# EAGLE schematic fadecandybreakout (EAGLE 6.5.0)
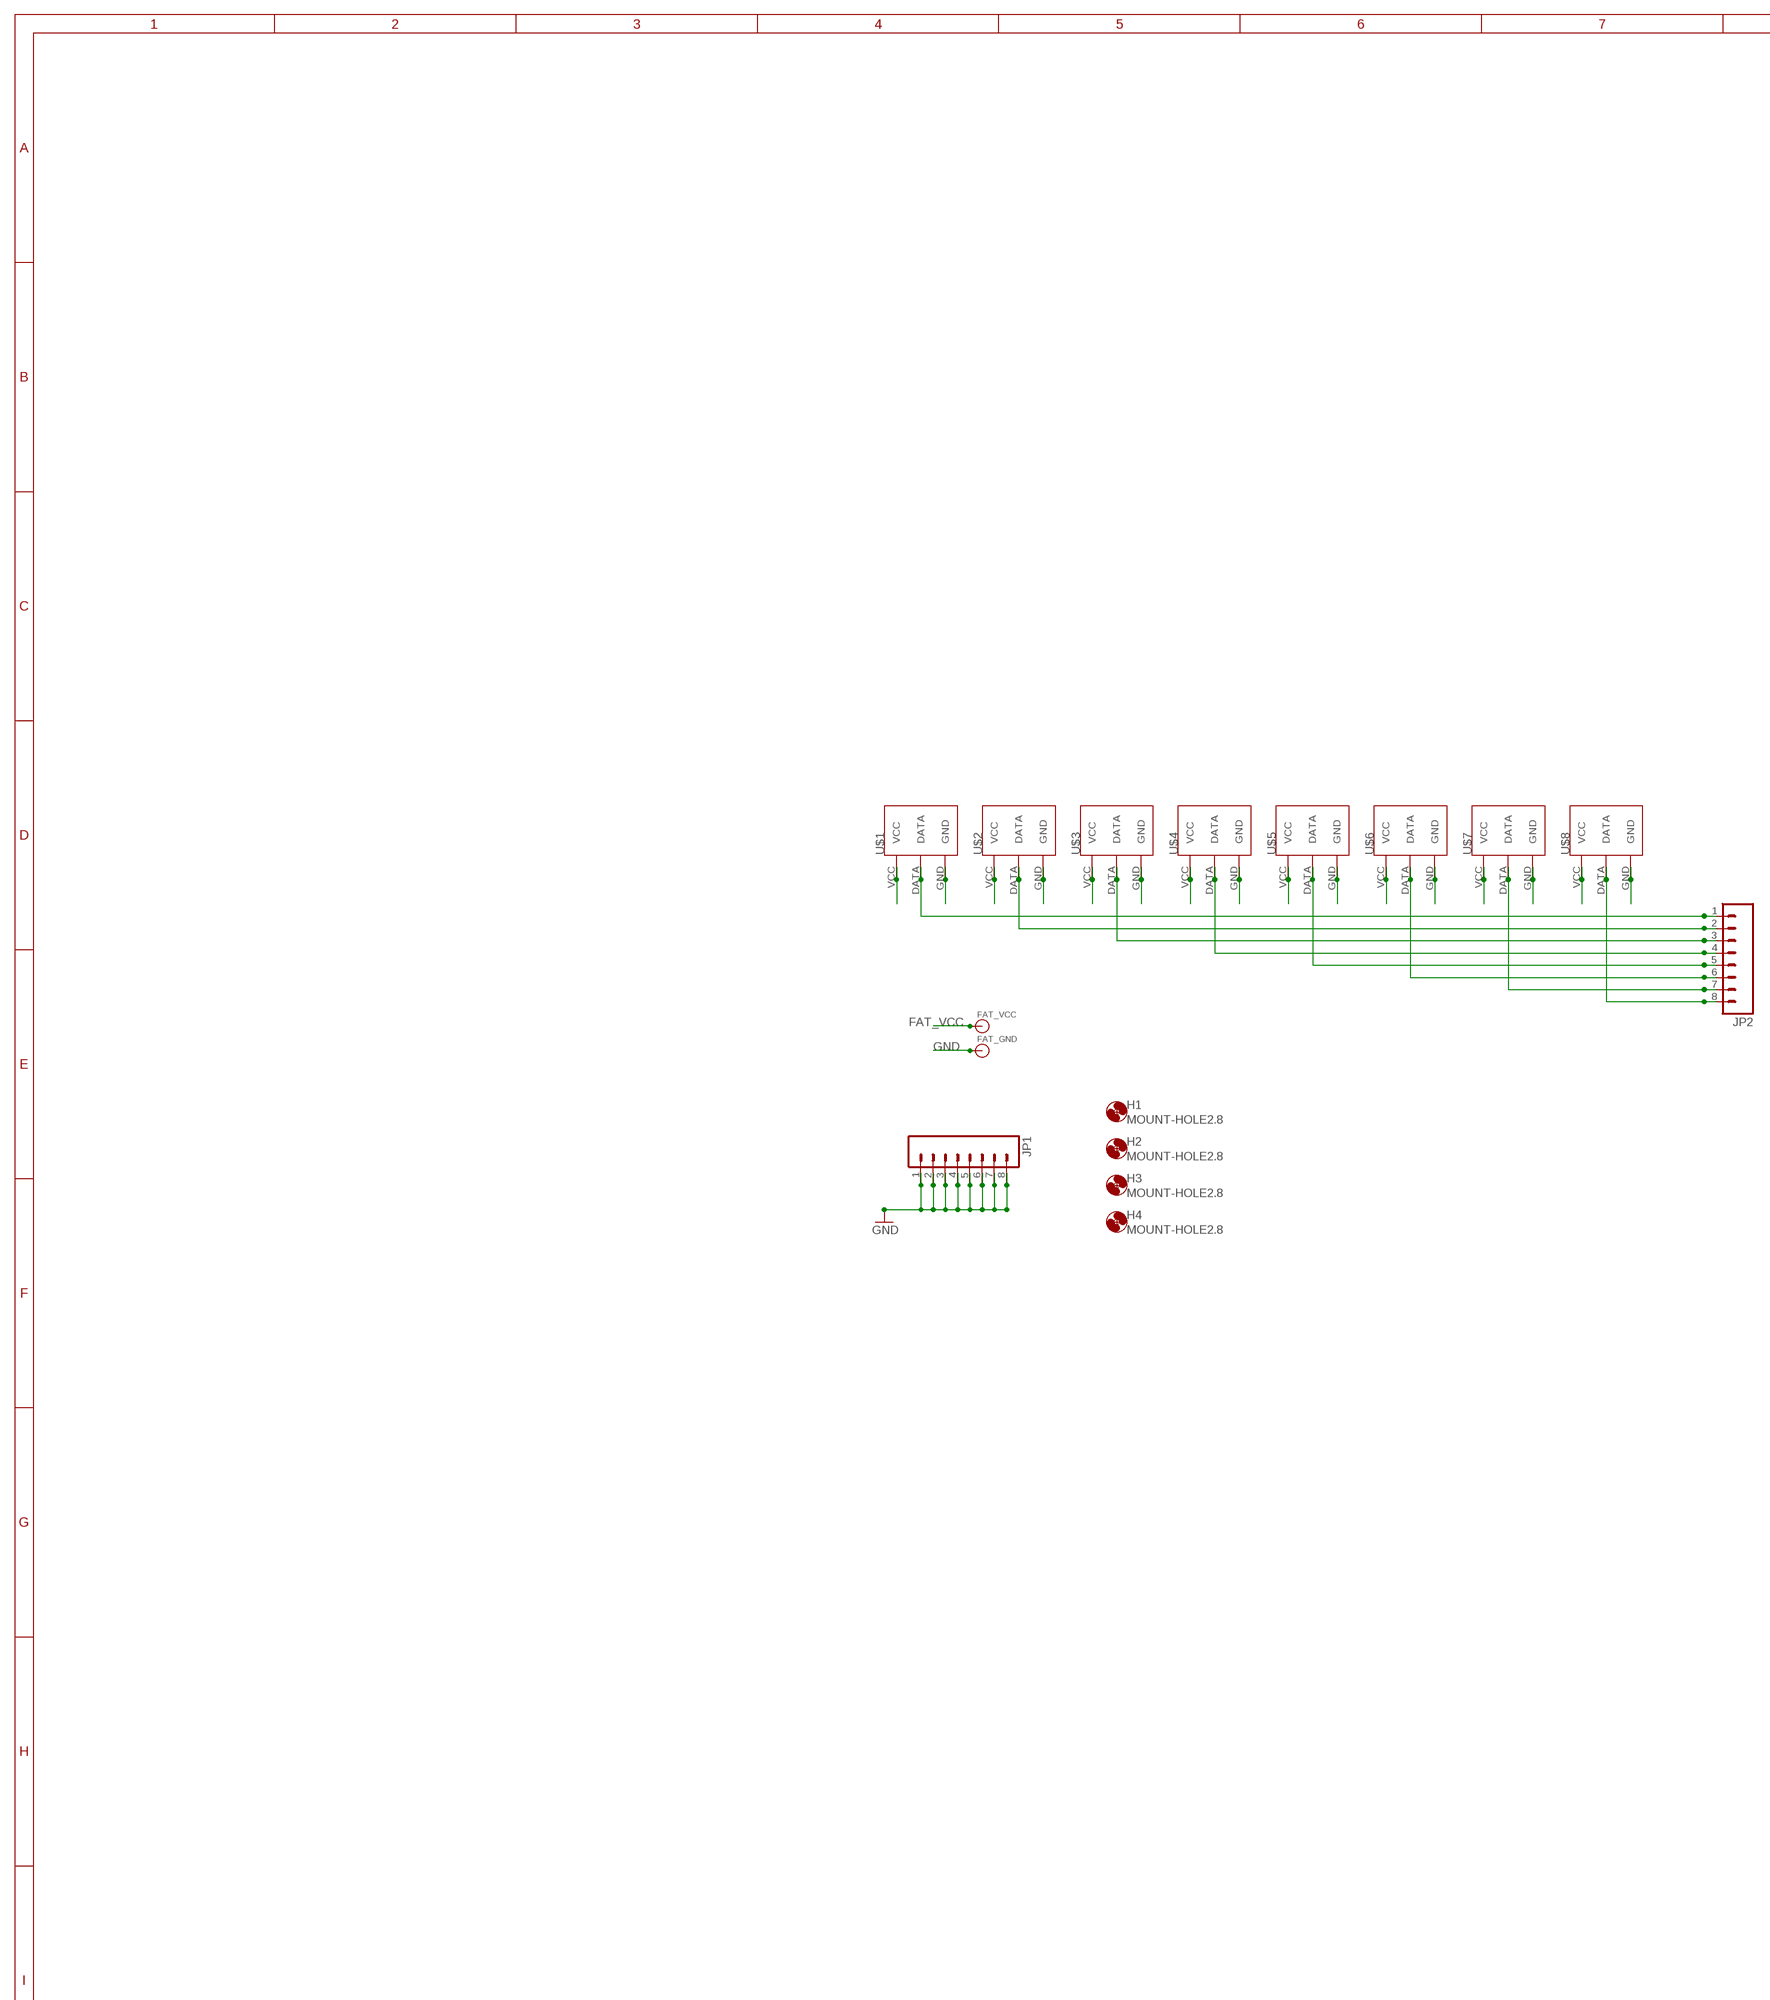
[diagram p0: schematic, sheet 1, part 1 of 2]
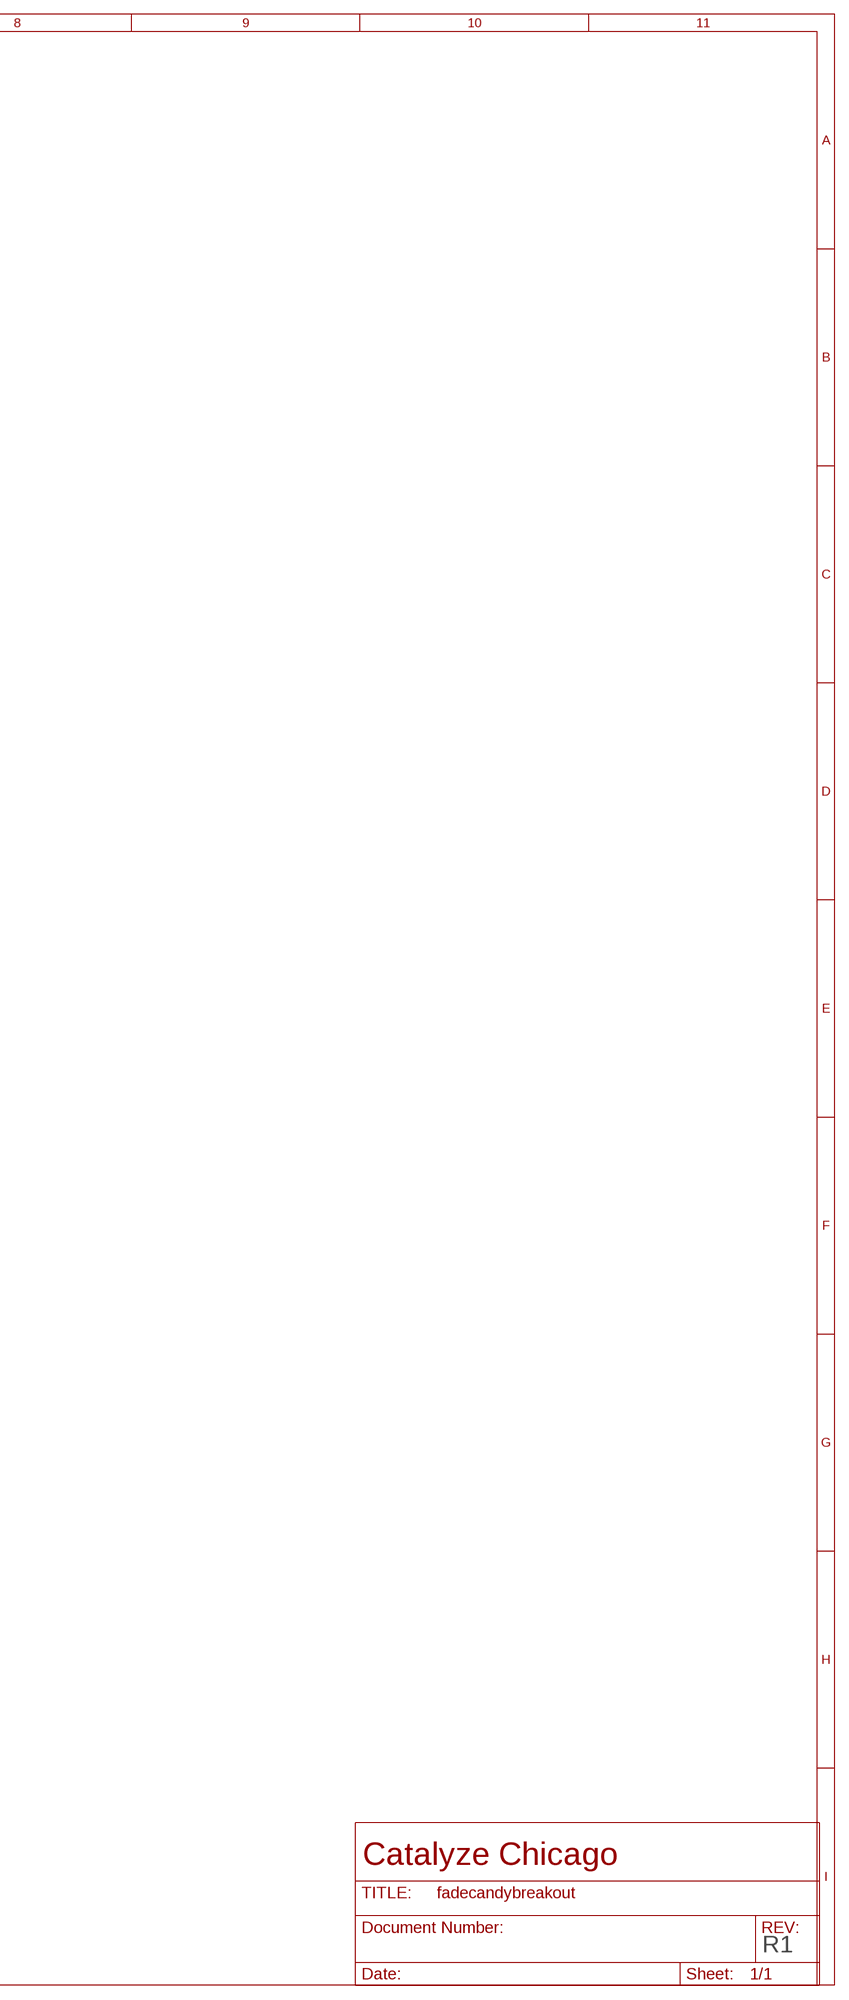
[diagram p1: schematic, sheet 1, part 2 of 2]

## Parts
FAT_GND  BANANA_CONN  [BANANA_CONN]
FAT_VCC  BANANA_CONN  [BANANA_CONN]
H1  MOUNT-HOLE2.8  [2,8]
H2  MOUNT-HOLE2.8  [2,8]
H3  MOUNT-HOLE2.8  [2,8]
H4  MOUNT-HOLE2.8  [2,8]
JP1  M081X08  [1X08]
JP2  M081X08  [1X08]
U$1  OSTOQ035450  [OSTOQ035450]
U$2  OSTOQ035450  [OSTOQ035450]
U$3  OSTOQ035450  [OSTOQ035450]
U$4  OSTOQ035450  [OSTOQ035450]
U$5  OSTOQ035450  [OSTOQ035450]
U$6  OSTOQ035450  [OSTOQ035450]
U$7  OSTOQ035450  [OSTOQ035450]
U$8  OSTOQ035450  [OSTOQ035450]

## Nets
FAT_VCC: FAT_VCC.P$1 U$1.VCC U$2.VCC U$3.VCC U$4.VCC U$5.VCC U$6.VCC U$7.VCC U$8.VCC
GND: FAT_GND.P$1 JP1.1 JP1.2 JP1.3 JP1.4 JP1.5 JP1.6 JP1.7 JP1.8 U$1.GND U$2.GND U$3.GND U$4.GND U$5.GND U$6.GND U$7.GND U$8.GND
N$1: JP2.1 U$1.DATA
N$2: JP2.2 U$2.DATA
N$3: JP2.3 U$3.DATA
N$4: JP2.4 U$4.DATA
N$5: JP2.5 U$5.DATA
N$6: JP2.6 U$6.DATA
N$7: JP2.7 U$7.DATA
N$8: JP2.8 U$8.DATA

## Notes on the sheet
- FAT_VCC
- GND
- Catalyze Chicago
- R1

## Library data of the parts
FAT_GND FAT_VCC = SparkFun-Connectors:BANANA_CONN: Through-hole banana jack
H1-H4 = holes:MOUNT-HOLE: MOUNTING HOLE with drill center marker
JP1 JP2 = SparkFun-Connectors:M08: Header 8 Standard 8-pin 0.1" header. Use with straight break away headers (SKU : PRT-00116), right angle break away headers (PRT-00553), swiss pins (PRT-00743), machine pins (PRT-00117), and female headers (PRT-00115).
U$1-U$8 = OSTOQ035450:OSTOQ035450